# EAGLE design T09_Signal Senders_Build (EAGLE 6.3)
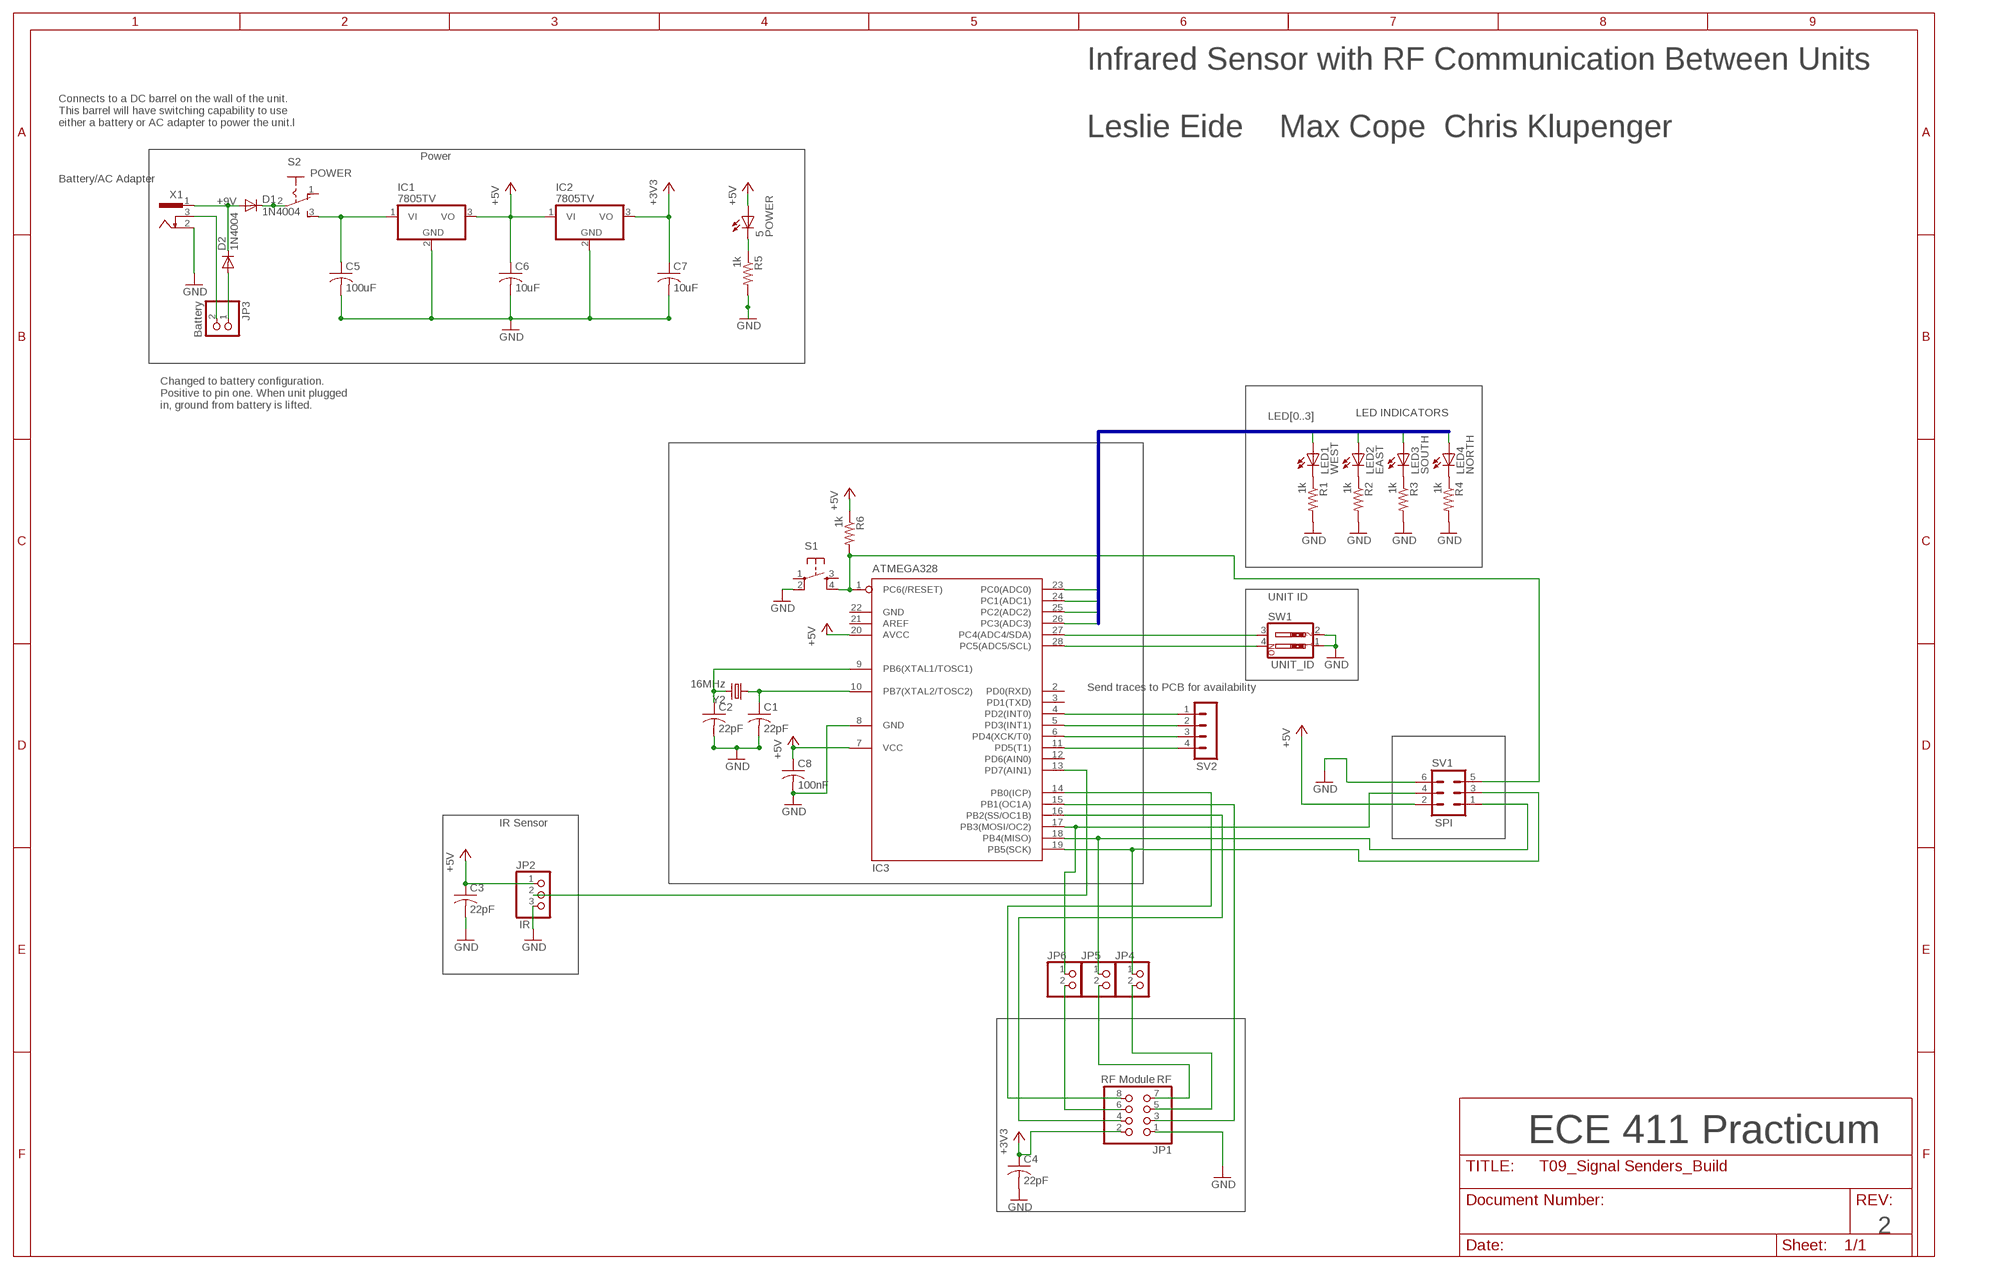
[diagram p0: schematic, sheet 1]

## Parts
5  POWER  LED3MM  [LED3MM]
C1  22pF  C-USC0805  [C0805]
C2  22pF  C-USC0805  [C0805]
C3  22pF  C-USC0805  [C0805]
C4  22pF  C-USC0805  [C0805]
C5  100uF  C-US050-075X075  [C050-075X075]
C6  10uF  C-USC0805  [C0805]
C7  10uF  C-USC0805  [C0805]
C8  100nF  C-USC0805  [C0805]
D1  1N4004  [DO41-10]
D2  1N4004  [DO41-10]
IC1  7805TV  [TO220V]
IC2  7805TV  [TO220V]
IC3  ATMEGA328  MEGA8-P  [DIL28-3]
JP1  RF  PINHD-2X4  [2X04]
JP2  IR  PINHD-1X3  [1X03]
JP3  Battery  PINHD-1X2  [1X02]
JP4  PINHD-1X2  [1X02]
JP5  PINHD-1X2  [1X02]
JP6  PINHD-1X2  [1X02]
LED1  WEST  LED3MM  [LED3MM]
LED2  EAST  LED3MM  [LED3MM]
LED3  SOUTH  LED3MM  [LED3MM]
LED4  NORTH  LED3MM  [LED3MM]
R1  1k  R-US_M0805  [M0805]
R2  1k  R-US_M0805  [M0805]
R3  1k  R-US_M0805  [M0805]
R4  1k  R-US_M0805  [M0805]
R5  1k  R-US_M0805  [M0805]
R6  1k  R-US_M0805  [M0805]
S1  TAC_SWITCHPTH  [TACTILE-PTH]
S2  POWER  M251  [M251]
SV1  SPI  MA03-2  [MA03-2]
SV2  MA04-1  [MA04-1]
SW1  UNIT_ID  SW_DIP-2  [EDG-02]
X1  733980-62  [733980-62]
Y2  16MHz  CRYSTALHC49US  [HC49US]

## Nets
+3V3: C4.1 C7.1 IC2.3(VO) JP1.2
+5V: 5.A C3.1 C6.1 C8.1 IC1.3(VO) IC2.1(VI) IC3.7(VCC) IC3.20(AVCC) JP2.1 R6.1 SV1.2
+9V: D1.A D2.C X1.1
GND: C1.2 C2.2 C3.2 C4.2 C5.2 C6.2 C7.2 C8.2 IC1.2(GND) IC2.2(GND) IC3.8(GND) JP1.1 JP2.3 R1.2 R2.2 R3.2 R4.2 R5.2 S1.2 SV1.6 SW1.1 SW1.2 X1.2
LED0: IC3.23(PC0(ADC0)) LED1.A
LED1: IC3.24(PC1(ADC1)) LED2.A
LED2: IC3.25(PC2(ADC2)) LED3.A
LED3: IC3.26(PC3(ADC3)) LED4.A
N$1: IC3.1(PC6(/RESET)) R6.2 S1.4 SV1.5
N$2: C1.1 IC3.10(PB7(XTAL2/TOSC2)) Y2.1
N$3: C2.1 IC3.9(PB6(XTAL1/TOSC1)) Y2.2
N$4: IC3.13(PD7(AIN1)) JP2.2
N$5: LED1.K(C) R1.1
N$6: LED2.K(C) R2.1
N$7: LED3.K(C) R3.1
N$8: LED4.K(C) R4.1
N$9: IC3.27(PC4(ADC4/SDA)) SW1.3
N$10: IC3.28(PC5(ADC5/SCL)) SW1.4
N$11: IC3.4(PD2(INT0)) SV2.1
N$12: IC3.5(PD3(INT1)) SV2.2
N$13: D2.A JP3.1
N$14: JP3.2 X1.3
N$15: IC3.6(PD4(XCK/T0)) SV2.3
N$16: IC3.11(PD5(T1)) SV2.4
N$18: 5.K(C) R5.1
N$22: C5.1 IC1.1(VI) S2.3(S)
N$23: D1.C S2.2(P)
N$31: IC3.18(PB4(MISO)) JP5.1 SV1.1
N$32: IC3.17(PB3(MOSI/OC2)) JP6.1 SV1.4
N$33: IC3.19(PB5(SCK)) JP4.1 SV1.3
N$34: IC3.16(PB2(SS/OC1B)) JP1.4
N$35: IC3.14(PB0(ICP)) JP1.8
N$36: IC3.15(PB1(OC1A)) JP1.3
N$37: JP1.6 JP6.2
N$38: JP1.7 JP5.2
N$39: JP1.5 JP4.2
Unconnected: IC3.2(PD0(RXD)) IC3.3(PD1(TXD)) IC3.12(PD6(AIN0)) IC3.21(AREF) S1.1 S1.3 S2.1(O)

## Buses
LED[0..3]

## Notes on the sheet
- Connects to a DC barrel on the wall of the unit.
  This barrel will have switching capability to use
  either a battery or AC adapter to power the unit.l
- Infrared Sensor with RF Communication Between Units
  
  Leslie Eide    Max Cope  Chris Klupenger
- Power
- Battery/AC Adapter
- Changed to battery configuration.
  Positive to pin one. When unit plugged
  in, ground from battery is lifted.
- LED INDICATORS
- UNIT ID
- Send traces to PCB for availability
- IR Sensor
- RF Module
- ECE 411 Practicum
- 2

## Power pins joined to a net without a drawn wire
GND: IC3.22(GND)

## Library data of the parts
5 LED1-LED4 = led:LED: LED OSRAM: - CHIPLED LG R971, LG N971, LY N971, LG Q971, LY Q971, LO R971, LY R971 LH N974, LH R974 LS Q976, LO Q976, LY Q976 LO Q996 - Hyper CHIPLED LW Q18S LB Q993, LB Q99A, LB R99A - SideLED LS A670, LO A670, LY A670, LG A670, LP A670 LB A673, LV A673, LT A673, LW A673 LH A674 LY A675 LS A676, LA A676, LO A676, LY A676, LW A676 LS A679, LY A679, LG A679 - Hyper Micro SIDELED® LS Y876, LA Y876, LO Y876, LY Y876 LT Y87S - SmartLED LW L88C, LW L88S LB L89C, LB L89S, LG L890 LS L89K, LO L89K, LY L89K LS L896, LA L896, LO L896, LY L896 - TOPLED LS T670, LO T670, LY T670, LG T670, LP T670 LSG T670, LSP T670, LSY T670, LOP T670, LYG T670 LG T671, LOG T671, LSG T671 LB T673, LV T673, LT T673, LW T673 LH T674 LS T676, LA T676, LO T676, LY T676, LB T676, LH T676, LSB T676, LW T676 LB T67C, LV T67C, LT T67C, LS T67K, LO T67K, LY T67K, LW E67C LS E67B, LA E67B, LO E67B, LY E67B, LB E67C, LV E67C, LT E67C LW T67C LS T679, LY T679, LG T679 LS T770, LO T770, LY T770, LG T770, LP T770 LB T773, LV T773, LT T773, LW T773 LH T774 LS E675, LA E675, LY E675, LS T675 LS T776, LA T776, LO T776, LY T776, LB T776 LHGB T686 LT T68C, LB T68C - Hyper Mini TOPLED® LB M676 - Mini TOPLED Santana® LG M470 LS M47K, LO M47K, LY M47K Source: http://www.osram.convergy.de LUXEON: - LUMILED® LXK2-PW12-R00, LXK2-PW12-S00, LXK2-PW14-U00, LXK2-PW14-V00 LXK2-PM12-R00, LXK2-PM12-S00, LXK2-PM14-U00 LXK2-PE12-Q00, LXK2-PE12-R00, LXK2-PE12-S00, LXK2-PE14-T00, LXK2-PE14-U00 LXK2-PB12-K00, LXK2-PB12-L00, LXK2-PB12-M00, LXK2-PB14-N00, LXK2-PB14-P00, LXK2-PB14-Q00 LXK2-PR12-L00, LXK2-PR12-M00, LXK2-PR14-Q00, LXK2-PR14-R00 LXK2-PD12-Q00, LXK2-PD12-R00, LXK2-PD12-S00 LXK2-PH12-R00, LXK2-PH12-S00 LXK2-PL12-P00, LXK2-PL12-Q00, LXK2-PL12-R00 Source: www.luxeon.com KINGBRIGHT: KA-3528ASYC Source: www.kingbright.com
C1-C8 = rcl:C-US: CAPACITOR, American symbol
D1 D2 = diode:1N4004: DIODE general purpose rectifier, 1 A
IC1 IC2 = linear:78*: Positive VOLTAGE REGULATOR Source: http://cache.national.com/ds/LM/LM78L05.pdf http://www.fairchildsemi.com/ds/LM/LM7805.pdf
IC3 = atmel:MEGA8-P: MICROCONTROLLER 8 Kbytes FLASH, 1 kbytes SRAM, 512 bytes EEPROM, USART, 4-channel 10 bit ADC, 2-channel 8 bit ADC Pin compatible with Atmega48, ATMega88, ATMega168 Source: avr.lbr; OC_FARNELL: unknown; OC_NEWARK: unknown
JP1 = pinhead:PINHD-2X4: PIN HEADER
JP2 = pinhead:PINHD-1X3: PIN HEADER
JP3-JP6 = pinhead:PINHD-1X2: PIN HEADER
R1-R6 = rcl:R-US_: RESISTOR, American symbol
S1 = SparkFun-Electromechanical:TAC_SWITCH: Momentary Switch Button commonly used for reset or general input. Spark Fun Electronics SKU : COM-00097 SMT- SWCH-08247
S2 = switch:M251: SLIDING SWITCH Mors, distributor Buerklin, 11G702
SV1 = con-lstb:MA03-2: PIN HEADER; OC_FARNELL: unknown; OC_NEWARK: unknown
SV2 = con-lstb:MA04-1: PIN HEADER; OC_FARNELL: unknown; OC_NEWARK: unknown
SW1 = special:SW_DIP-2: DIP SWITCH
X1 = con-conrad:73398?: FEMALE PRINT CONNECTOR Niedervolt-Steckverbinder Distributor Conrad
Y2 = SparkFun-FreqCtrl:CRYSTAL: Various standard crystals. Proven footprints. Spark Fun Electronics SKU : COM-00534

## Net classes
0 default: width 0.305 mm, drill 0.508 mm, clearance 0.254 mm

## Board
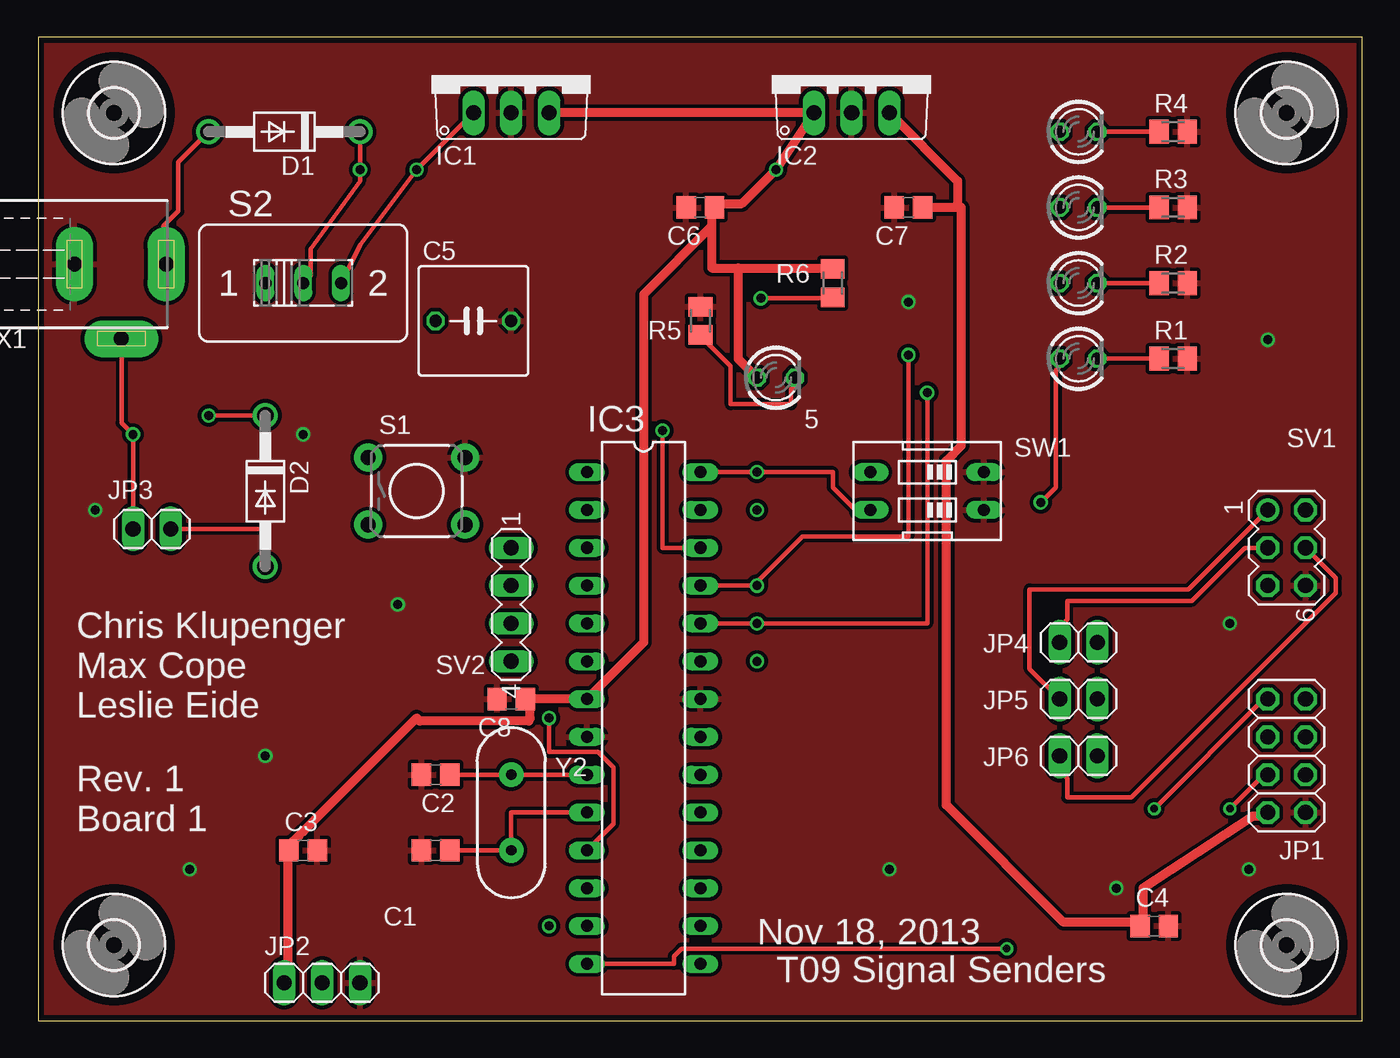
[diagram p1: board, top side]
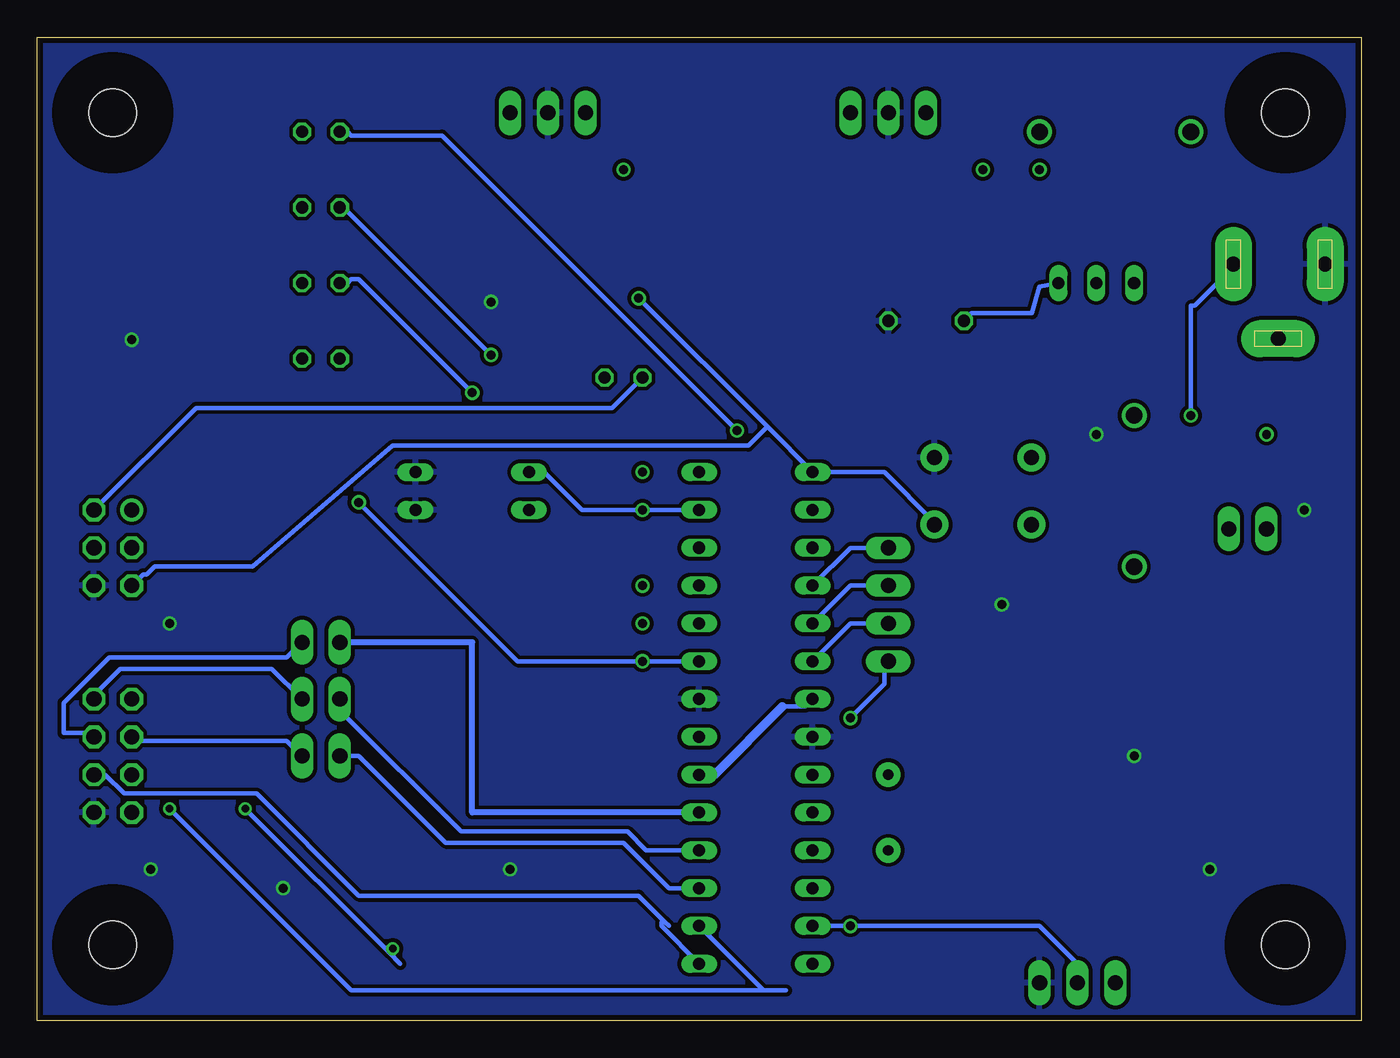
[diagram p2: board, bottom side, seen from below]

Size 88.9 x 66.04 mm. Coordinates in mm from the lower left corner, seen from the top.
Outline: 0,0 88.9,0 88.9,66.04 0,66.04 0,0
Copper layers (1*16): Top 0.0356mm / dielectric 1.5011mm / Bottom 0.0356mm
Design rules "LaenPCBOrder": minimum track width 6mil, minimum drill 13mil, track to track 6mil, track to pad 6mil, pad to pad 6mil, via to via 6mil, smd to smd 6mil, copper to edge 15mil, drill to drill 6mil, minimum pad ring 7mil, minimum via ring 7mil, stop-mask expansion 3mil, vias tented up to drill 0mil, thermal gap 10mil

### Footprints (pad centres in the part's own frame; a part is rotated, then mirrored left to right if it is on the bottom)
LED3MM = drill 0.813 octagon: A -1.27,0; K 1.27,0
C0805 = smd 1.3 x 1.5: 1 -0.95,0; 2 0.95,0
C050-075X075 = drill 0.813 octagon: 1 -2.54,0; 2 2.54,0
DO41-10 = drill 1.118: A 5.08,0; C -5.08,0
TO220V = drill 1.016 long: 1 -2.54,-2.54; 2 0,-2.54; 3 2.54,-2.54
DIL28-3 = drill 0.813 long: 1 -16.51,-3.81; 2 -13.97,-3.81; 3 -11.43,-3.81; 4 -8.89,-3.81; 5 -6.35,-3.81; 6 -3.81,-3.81; 7 -1.27,-3.81; 8 1.27,-3.81; 9 3.81,-3.81; 10 6.35,-3.81; 11 8.89,-3.81; 12 11.43,-3.81; 13 13.97,-3.81; 14 16.51,-3.81; 15 16.51,3.81; 16 13.97,3.81; 17 11.43,3.81; 18 8.89,3.81; 19 6.35,3.81; 20 3.81,3.81; 21 1.27,3.81; 22 -1.27,3.81; 23 -3.81,3.81; 24 -6.35,3.81; 25 -8.89,3.81; 26 -11.43,3.81; 27 -13.97,3.81; 28 -16.51,3.81
2X04 = drill 1.016 octagon: 1 -3.81,-1.27; 2 -3.81,1.27; 3 -1.27,-1.27; 4 -1.27,1.27; 5 1.27,-1.27; 6 1.27,1.27; 7 3.81,-1.27; 8 3.81,1.27
1X03 = drill 1.016 long: 1 -2.54,0; 2 0,0; 3 2.54,0
1X02 = drill 1.016 long: 1 -1.27,0; 2 1.27,0
M0805 = smd 1.3 x 1.6: 1 -0.95,0; 2 0.95,0
TACTILE-PTH = drill 1.016 pad 1.88: 1 -3.251,2.261; 2 3.251,2.261; 3 -3.251,-2.261; 4 3.251,-2.261
M251 = drill 0.813 long: 1 -2.54,0; 2 0,0; 3 2.54,0
MA03-2 = drill 1.016: 1 -2.54,-1.27 | drill 1.016 octagon: 2 -2.54,1.27; 3 0,-1.27; 4 0,1.27; 5 2.54,-1.27; 6 2.54,1.27
MA04-1 = drill 1.016 long: 1 -3.81,0; 2 -1.27,0; 3 1.27,0; 4 3.81,0
EDG-02 = drill 0.813 long: 1 -1.27,-3.81; 2 1.27,-3.81; 3 1.27,3.81; 4 -1.27,3.81
3,2 = hole 3.2: 0,0
733980-62 = drill 1 pad 2.5 long: 1 0,8.57; 2 0,2.42; 3 5,5.57
HC49US = drill 0.7 pad 1.651: 1 -2.54,0; 2 2.54,0

### Placement (x,y rotation side)
5  49.53,43.18 0 top
C1  26.67,11.43 180 top
C2  26.67,16.51 180 top
C3  17.78,11.43 0 top
C4  74.93,6.35 0 top
C5  29.21,46.99 0 top
C6  44.45,54.61 180 top
C7  58.42,54.61 180 top
C8  31.75,21.59 180 top
D1  16.51,59.69 180 top
D2  15.24,35.56 270 top
IC1  31.75,63.5 0 top
IC2  54.61,63.5 0 top
IC3  40.64,20.32 270 top
JP1  83.82,17.78 90 top
JP2  19.05,2.54 0 top
JP3  7.62,33.02 180 top
JP4  69.85,25.4 0 top
JP5  69.85,21.59 0 top
JP6  69.85,17.78 0 top
LED1  69.85,44.45 0 top
LED2  69.85,49.53 0 top
LED3  69.85,54.61 0 top
LED4  69.85,59.69 0 top
R1  76.2,44.45 0 top
R2  76.2,49.53 0 top
R3  76.2,54.61 0 top
R4  76.2,59.69 0 top
R5  44.45,46.99 90 top
R6  53.34,49.53 270 top
S1  25.4,35.56 0 top
S2  17.78,49.53 0 top
SV1  83.82,31.75 270 top
SV2  31.75,27.94 270 top
SW1  59.69,35.56 90 top
U$1  [3,2]  5.08,5.08 0 top
U$2  [3,2]  83.82,5.08 0 top
U$3  [3,2]  83.82,60.96 0 top
U$4  [3,2]  5.08,60.96 0 top
X1  0,50.8 270 top
Y2  31.75,13.97 90 top

### Tracks (layer width: path | path; a pad name or v marks a point on that pad's centre or on a via)
+3V3
  Top 0.305: 61.72,54.61 C7.1 | 74.17,6.6 74.17,6.35 C4.1 74.17,6.6
  Top 0.61: 61.72,54.61 61.72,56.39 IC2.3 | JP1.2 82.55,13.72 81.53,13.72 74.17,8.89 74.17,6.6 68.83,6.6 60.96,14.48 60.96,37.59 61.98,38.61 61.98,54.61 C7.1
+5V  (via drill 0.6)
  Top 0.305: 16.76,11.43 C3.1 | 45.21,54.61 C6.1 45.47,54.61 45.47,54.86 | 53.34,50.55 R6.1 | 32.51,21.59 C8.1 | 25.6,20.12 25.4,20.32 | 32.92,20.12 33.02,20.32 | 17.53,12.45 17.53,12.7 17.78,12.7
  Top 0.61: 16.76,11.43 16.76,2.79 JP2.1 | 45.21,54.61 45.21,53.34 | 45.21,53.34 45.21,50.55 46.99,50.55 | 46.99,50.55 53.34,50.55 | 5.A 46.99,44.45 46.99,50.55 | 45.47,54.86 47.24,54.86 v49.53,57.15 IC2.1 IC1.3 | 45.21,53.34 40.64,48.77 40.64,25.4 IC3.7 C8.1 33.02,21.27 33.02,20.32 | 17.78,12.7 25.4,20.32 | 32.92,20.12 25.6,20.12 | 17.53,12.45 16.76,11.68 C3.1
  Bottom 0.305: IC3.7 37.34,21.08 38.86,21.08 | IC3.20 43.43,16.51 | SV1.2 78.23,41.15 50.29,41.15 5.A
  Bottom 0.61: 43.43,16.51 38.86,21.08
+9V  (via drill 0.6)
  Top 0.305: D1.A 9.4,57.66 9.4,54.36 8.38,53.34 8.38,50.8 X1.1 | v11.43,40.64 D2.C
  Bottom 0.305: v11.43,40.64 11.43,48.01 11.18,48.01 8.38,50.8 X1.1
GND  (via drill 0.6)
  other vias: 15.24,17.78 3.81,34.29 10.16,10.16 57.15,10.16 24.13,27.94 80.01,26.67 81.28,10.16 82.55,45.72 17.78,39.37 58.42,48.26 72.39,8.89
  pour Top: 0,66.04 88.9,66.04 88.9,0 0,0
  pour Bottom: 0,66.04 0,0 88.9,0 88.9,66.04
LED0  (via drill 0.6, 0.61)
  Top 0.305: v67.31,34.8 68.33,35.81 68.33,43.69 68.58,43.94 LED1.A
  Bottom 0.305: IC3.23 v48.26,24.13 56.64,24.13 v67.31,34.8
LED1  (via drill 0.6, 0.61)
  Top 0.305: IC3.24 v48.26,26.67 59.69,26.67 v59.69,42.16
  Bottom 0.305: v59.69,42.16 67.31,49.78 67.82,49.78 68.07,49.53 LED2.A
LED2  (via drill 0.6, 0.61)
  Top 0.305: v48.26,29.21 48.01,29.21 | 48.01,29.21 IC3.25 | 48.01,29.21 51.31,32.51 58.42,32.51 v58.42,44.7
  Bottom 0.305: v58.42,44.7 68.33,54.61 LED3.A
LED3  (via drill 0.61)
  Top 0.305: IC3.26 41.91,31.75 v41.91,39.62
  Bottom 0.305: v41.91,39.62 61.72,59.44 67.82,59.44 68.07,59.69 LED4.A
N$1  (via drill 0.61)
  Top 0.305: v48.51,48.51 53.34,48.51 R6.2
  Bottom 0.305: 39.88,39.88 IC3.1 32,36.83 28.7,33.53 S1.4 | 39.88,39.88 v48.51,48.51 | SV1.5 81.79,29.97 81.53,29.97 81.03,30.48 74.42,30.48 65.02,38.61 41.15,38.61 39.88,39.88
N$2
  Top 0.305: C1.1 Y2.1 31.75,13.97 IC3.10
N$3
  Top 0.305: C2.1 Y2.2 IC3.9
N$4  (via drill 0.6)
  Bottom 0.305: IC3.13 v34.29,6.35 21.59,6.35 19.05,3.81 JP2.2
N$5
  Top 0.305: LED1.K R1.1
N$6
  Top 0.305: LED2.K R2.1
N$7
  Top 0.305: LED3.K R3.1
N$8
  Top 0.305: LED4.K R4.1
N$9  (via drill 0.6)
  Bottom 0.305: IC3.27 v48.26,34.29 52.32,34.29 54.86,36.83 SW1.3
N$10  (via drill 0.6)
  Top 0.305: IC3.28 v48.26,36.83 53.34,36.83 53.34,35.81 54.86,34.29 SW1.4
N$11
  Bottom 0.305: IC3.4 34.29,31.75 SV2.1
N$12
  Bottom 0.305: IC3.5 34.29,29.21 SV2.2
N$13
  Top 0.305: JP3.1 15.24,33.02 D2.A
N$14  (via drill 0.6)
  Top 0.305: JP3.2 v6.35,39.37 5.59,40.13 5.59,45.72 X1.3
N$15
  Bottom 0.305: IC3.6 34.29,26.67 SV2.3
N$16  (via drill 0.61)
  Top 0.305: 35.81,11.68 35.81,11.43 IC3.11 38.61,13.21 38.61,17.02 37.59,18.03 34.29,18.03 v34.29,20.32
  Bottom 0.305: v34.29,20.32 32,22.61 32,24.13 SV2.4
N$18
  Top 0.305: 5.K 50.8,42.67 50.55,42.42 50.55,41.4 46.48,41.4 46.48,43.94 44.45,45.97 R5.1
N$22  (via drill 0.6)
  Top 0.305: IC1.1 v25.4,57.15 21.59,52.07 S2.3
  Bottom 0.305: C5.1 26.16,47.5 22.1,47.5 21.59,49.28 S2.3
N$23  (via drill 0.6)
  Top 0.305: S2.2 18.29,50.04 18.29,51.82 21.59,56.39 v21.59,57.15 D1.C
N$31
  Top 0.305: SV1.1 77.22,28.96 66.55,28.96 66.55,23.62 JP5.1
  Bottom 0.305: IC3.18 48.01,11.43 49.28,12.7 60.45,12.7 68.58,20.83 JP5.1
N$32
  Top 0.305: SV1.4 87.12,29.72 87.12,28.7 73.41,14.99 69.09,14.99 69.09,16.26 68.58,16.76 JP6.1
  Bottom 0.305: IC3.17 46.48,8.89 49.53,11.94 61.47,11.94 67.31,17.78 JP6.1
N$33
  Top 0.305: SV1.3 81.03,31.75 77.47,28.19 69.09,28.19 69.09,26.92 68.58,26.42 JP4.1
  Bottom 0.406: IC3.19 59.69,13.97 59.69,25.4 JP4.1
N$34  (via drill 0.51)
  Top 0.305: v80.01,14.22 82.3,16.51 JP1.4
  Bottom 0.305: 40.13,2.03 67.82,2.03 v80.01,14.22 | 40.13,2.03 38.61,2.03 | 40.13,2.03 IC3.16
N$35  (via drill 0.51)
  Top 0.305: v74.93,14.22 82.3,21.59 JP1.8 | IC3.14 42.67,3.81 42.67,4.32 43.18,4.83 v65.02,4.83
  Bottom 0.305: v74.93,14.22 65.28,4.57 | 65.28,4.57 64.52,3.81 | 65.28,4.57 v65.02,4.83
N$36
  Bottom 0.305: 46.74,6.6 48.51,8.38 67.31,8.38 74.17,15.24 83.06,15.24 84.33,16.51 JP1.3 | 46.74,6.6 46.48,6.35 | IC3.15 46.99,6.35 46.99,6.6 46.74,6.6
N$37
  Bottom 0.305: JP6.2 72.14,18.8 82.3,18.8 JP1.6
N$38
  Bottom 0.305: JP5.2 73.15,23.62 83.31,23.62 85.09,21.84 JP1.7
N$39
  Bottom 0.305: JP4.2 72.14,24.38 84.07,24.38 87.12,21.34 87.12,19.3 85.34,19.3 JP1.5

### Text on the board
tNames: Chris Klupenger / Max Cope / Leslie Eide | Rev. 1 / Board 1 | Nov 18, 2013 | T09 Signal Senders